# Altium schematic sheet Main.SchDoc
size A4
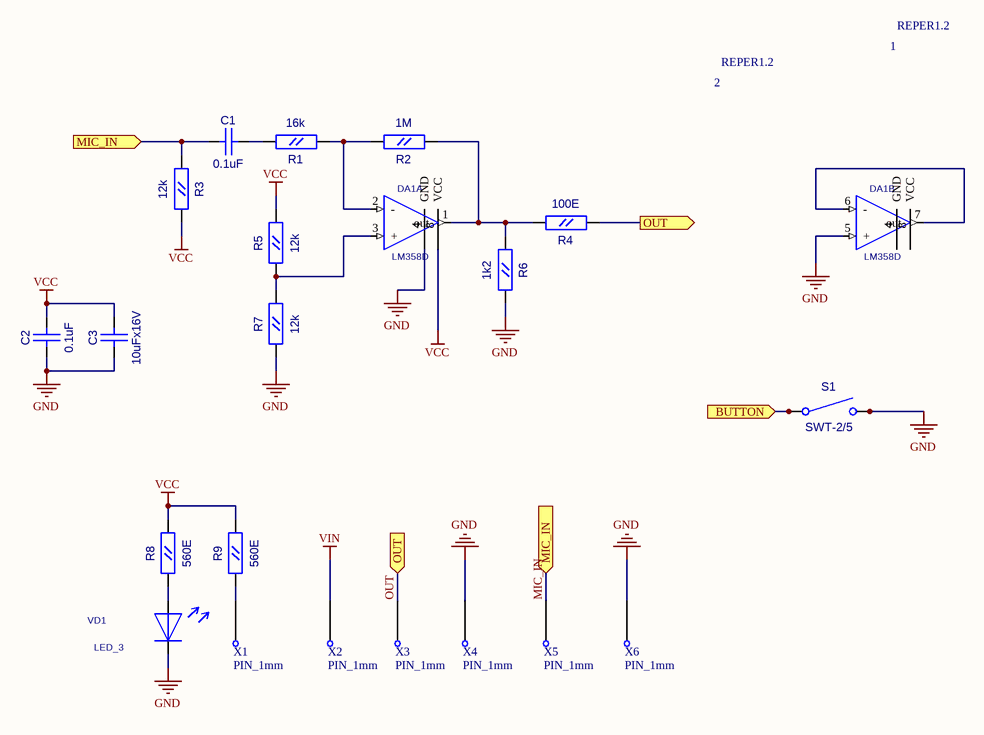
[diagram p0: Main.SchDoc]

## Parts
1  REPER1.2  [REPER1.2]
2  REPER1.2  [REPER1.2]
C1  0.1uF  [CC0805]
C2  0.1uF  [CC0805]
C3  10uFx16V  [CC0805]
DA1  LM358D  [SO-8]  (parts A,B of 2)
R1  16k  [RC0805]
R2  1M  [RC0805]
R3  12k  [RC0805]
R4  100E  [RC0805]
R5  12k  [RC0805]
R6  1k2  [RC0805]
R7  12k  [RC0805]
R8  560E  [RC0805]
R9  560E  [RC0805]
S1  SWT-2/5  [7906H-1]
VD1  LED_3  [LED3]
X1  PIN_1mm  [PIN_1mm]
X2  PIN_1mm  [PIN_1mm]
X3  PIN_1mm  [PIN_1mm]
X4  PIN_1mm  [PIN_1mm]
X5  PIN_1mm  [PIN_1mm]
X6  PIN_1mm  [PIN_1mm]

## Ports
BUTTON (in), MIC_IN (in), OUT (in), OUT (out)

## Nets
GND: C2.1(A) C3.1(A) DA1.4(GND) DA1.5(+) R6.2(B) R7.1(A) S1.3(C2) S1.4 VD1.1 X4.1 X6.1
VCC: C2.2(B) C3.2(B) DA1.8(VCC) R3.2(B) R5.2(B) R8.2(B) R9.2(B)
VIN: X2.1
BUTTON: S1.1(C1) S1.2 ; port BUTTON
MIC_IN: C1.1(A) R3.1(A) X5.1 ; port MIC_IN
OUT: R4.1(A) X3.1 ; port OUT
NetC1_2: C1.2(B) R1.2(B)
NetDA1_1: DA1.1(out) R2.1(A) R4.2(B) R6.1(A)
NetDA1_2: DA1.2(-) R1.1(A) R2.2(B)
NetDA1_3: DA1.3(+) R5.1(A) R7.2(B)
NetDA1_6: DA1.6(-) DA1.7(out)
NetR8_1: R8.1(A) VD1.2
NetR9_1: R9.1(A) X1.1

Not connected (* = marked no-connect by the designer): 1 1; 2 1

## Library data of the parts
C1-C3 = CC0805
  C1 C2: Value: 0.1uF
  C3: Value: 10uFx16V
R1-R9 = RC0805
  R1: Value: 16k
  R2: Value: 1M
  R3 R5 R7: Value: 12k
  R4: Value: 100E
  R6: Value: 1k2
  R8 R9: Value: 560E
S1 = SWT-2/5: Switch, Single Pole, Single Throw, Normally Open; Value: SWT-2/5
1 2 = REPER1.2: Value: *
DA1 = LM358D: Value: *
VD1 = LED_3: Value: *